# Altium schematic sheet Targets_old1.SchDoc: Shepherd - Target Interface
size A3; Author: Ingmar; CompanyName: NES Lab / TU Dresden
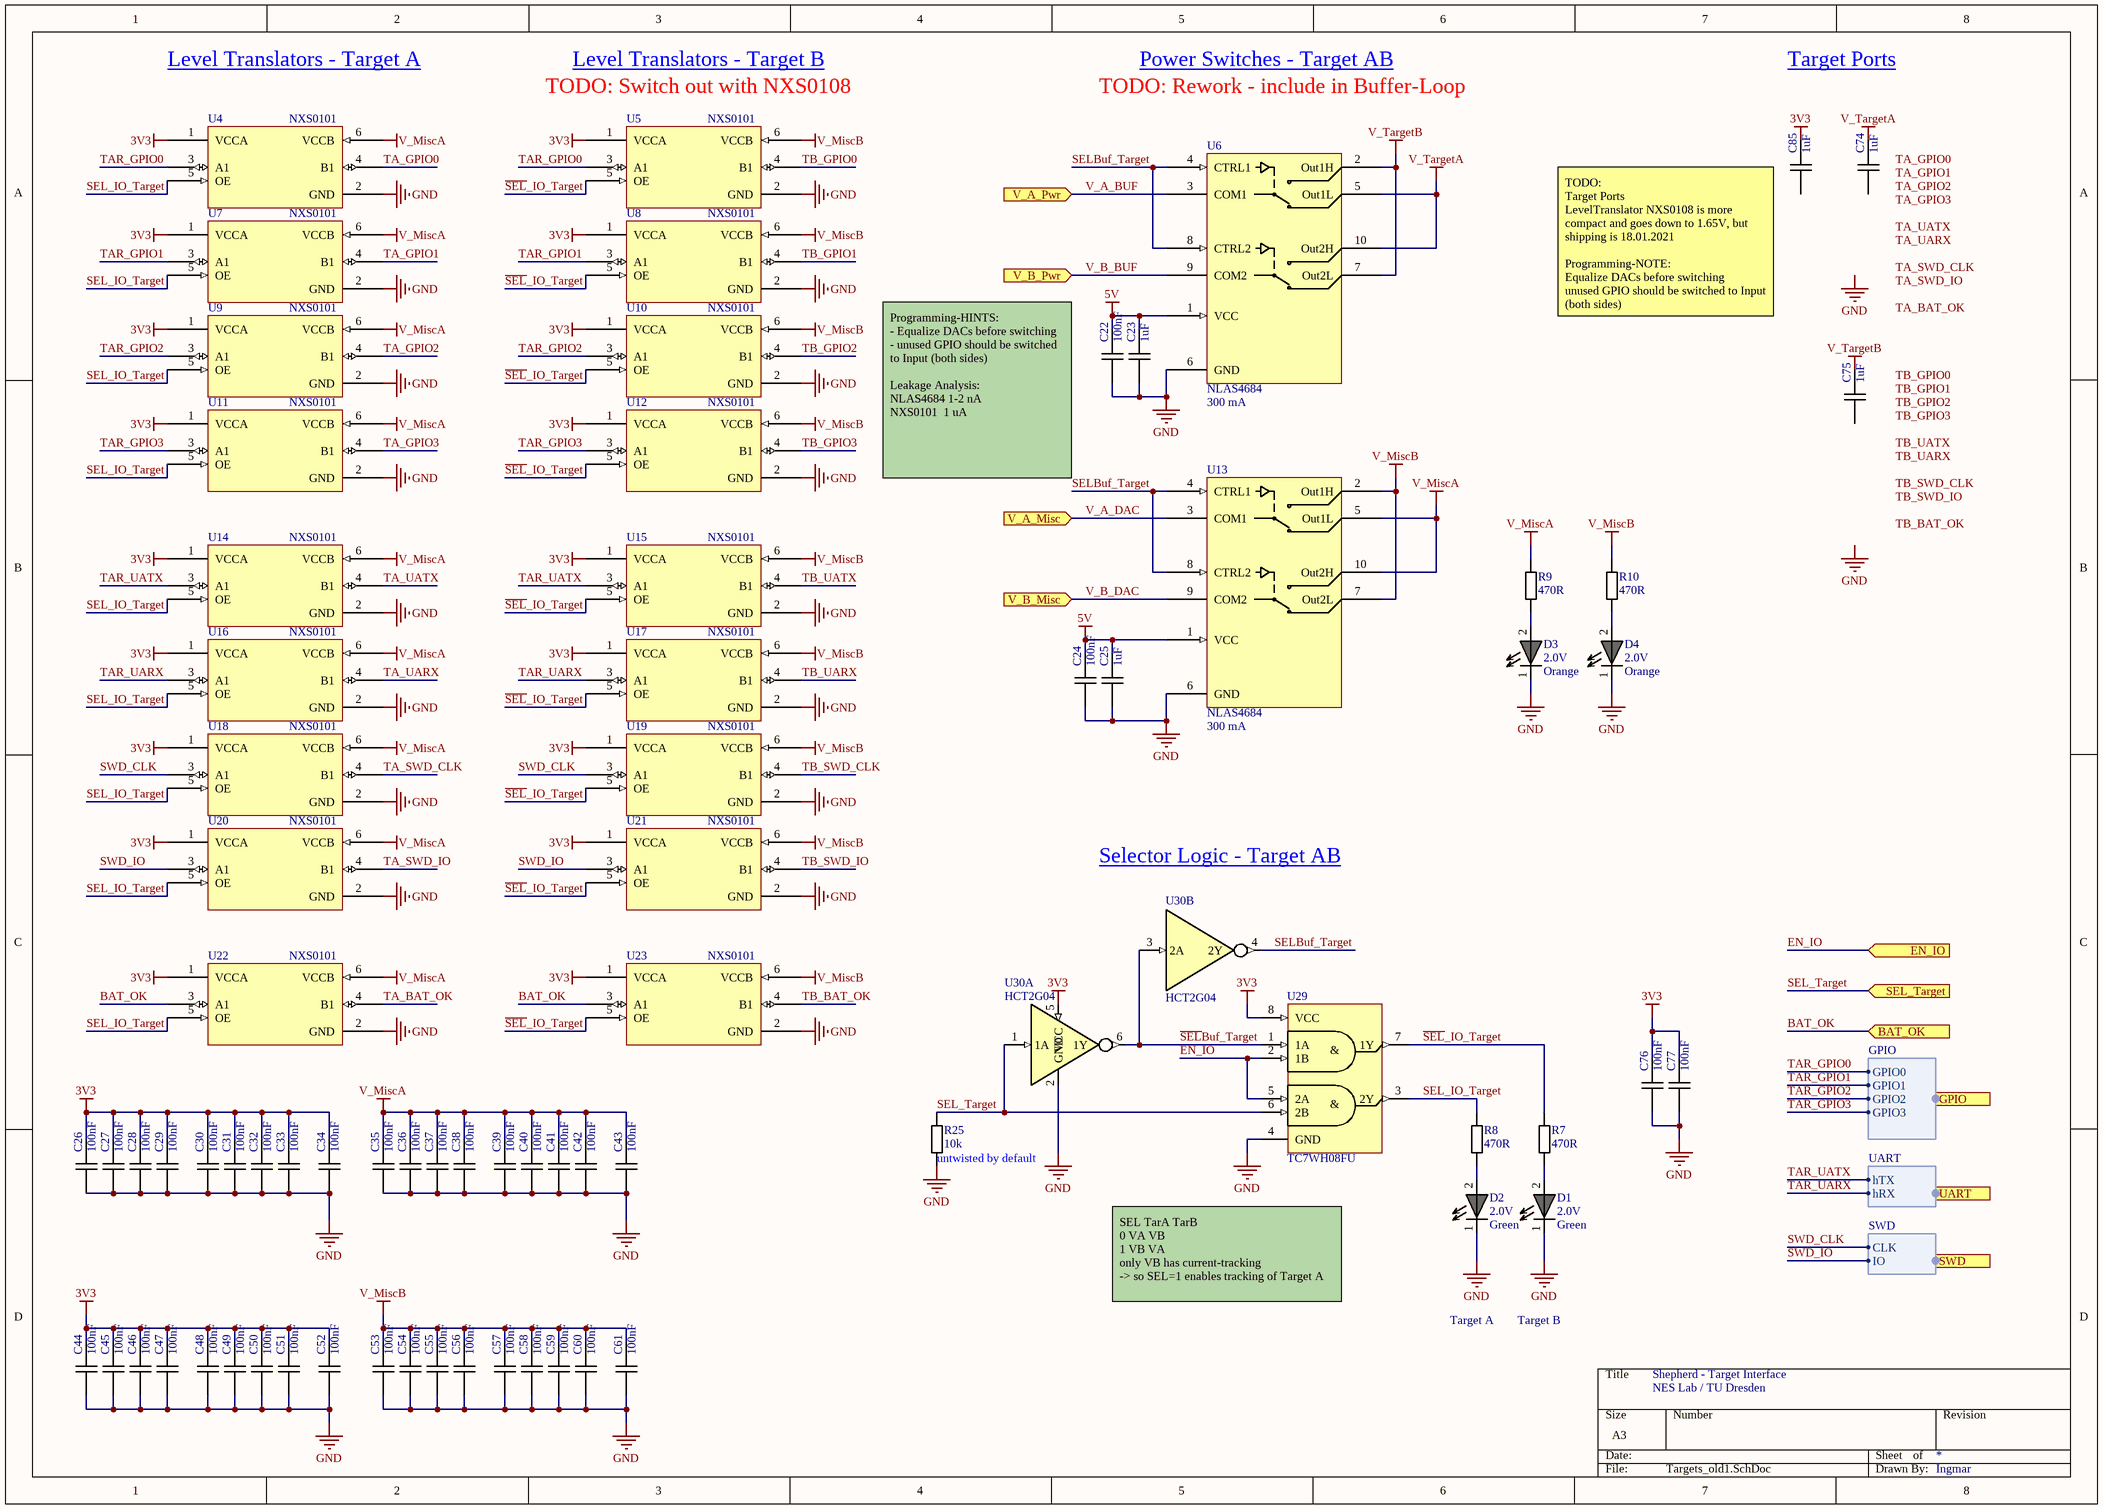
[diagram p0: Targets_old1.SchDoc]

## Parts
C22  value 100nF  [CAPC1005X06]  (hidden comment: .C_0402_100nF_10V)
C23  value 1uF  [CAPC1608X09]  (hidden comment: .C_0603_1uF_10V)
C24  value 100nF  [CAPC1005X06]  (hidden comment: .C_0402_100nF_10V)
C25  value 1uF  [CAPC1608X09]  (hidden comment: .C_0603_1uF_10V)
C26  value 100nF  [CAPC1005X06]  (hidden comment: .C_0402_100nF_10V)
C27  value 100nF  [CAPC1005X06]  (hidden comment: .C_0402_100nF_10V)
C28  value 100nF  [CAPC1005X06]  (hidden comment: .C_0402_100nF_10V)
C29  value 100nF  [CAPC1005X06]  (hidden comment: .C_0402_100nF_10V)
C30  value 100nF  [CAPC1005X06]  (hidden comment: .C_0402_100nF_10V)
C31  value 100nF  [CAPC1005X06]  (hidden comment: .C_0402_100nF_10V)
C32  value 100nF  [CAPC1005X06]  (hidden comment: .C_0402_100nF_10V)
C33  value 100nF  [CAPC1005X06]  (hidden comment: .C_0402_100nF_10V)
C34  value 100nF  [CAPC1005X06]  (hidden comment: .C_0402_100nF_10V)
C35  value 100nF  [CAPC1005X06]  (hidden comment: .C_0402_100nF_10V)
C36  value 100nF  [CAPC1005X06]  (hidden comment: .C_0402_100nF_10V)
C37  value 100nF  [CAPC1005X06]  (hidden comment: .C_0402_100nF_10V)
C38  value 100nF  [CAPC1005X06]  (hidden comment: .C_0402_100nF_10V)
C39  value 100nF  [CAPC1005X06]  (hidden comment: .C_0402_100nF_10V)
C40  value 100nF  [CAPC1005X06]  (hidden comment: .C_0402_100nF_10V)
C41  value 100nF  [CAPC1005X06]  (hidden comment: .C_0402_100nF_10V)
C42  value 100nF  [CAPC1005X06]  (hidden comment: .C_0402_100nF_10V)
C43  value 100nF  [CAPC1005X06]  (hidden comment: .C_0402_100nF_10V)
C44  value 100nF  [CAPC1005X06]  (hidden comment: .C_0402_100nF_10V)
C45  value 100nF  [CAPC1005X06]  (hidden comment: .C_0402_100nF_10V)
C46  value 100nF  [CAPC1005X06]  (hidden comment: .C_0402_100nF_10V)
C47  value 100nF  [CAPC1005X06]  (hidden comment: .C_0402_100nF_10V)
C48  value 100nF  [CAPC1005X06]  (hidden comment: .C_0402_100nF_10V)
C49  value 100nF  [CAPC1005X06]  (hidden comment: .C_0402_100nF_10V)
C50  value 100nF  [CAPC1005X06]  (hidden comment: .C_0402_100nF_10V)
C51  value 100nF  [CAPC1005X06]  (hidden comment: .C_0402_100nF_10V)
C52  value 100nF  [CAPC1005X06]  (hidden comment: .C_0402_100nF_10V)
C53  value 100nF  [CAPC1005X06]  (hidden comment: .C_0402_100nF_10V)
C54  value 100nF  [CAPC1005X06]  (hidden comment: .C_0402_100nF_10V)
C55  value 100nF  [CAPC1005X06]  (hidden comment: .C_0402_100nF_10V)
C56  value 100nF  [CAPC1005X06]  (hidden comment: .C_0402_100nF_10V)
C57  value 100nF  [CAPC1005X06]  (hidden comment: .C_0402_100nF_10V)
C58  value 100nF  [CAPC1005X06]  (hidden comment: .C_0402_100nF_10V)
C59  value 100nF  [CAPC1005X06]  (hidden comment: .C_0402_100nF_10V)
C60  value 100nF  [CAPC1005X06]  (hidden comment: .C_0402_100nF_10V)
C61  value 100nF  [CAPC1005X06]  (hidden comment: .C_0402_100nF_10V)
C74  value 1uF  [CAPC1608X09]  (hidden comment: .C_0603_1uF_10V)
C75  value 1uF  [CAPC1608X09]  (hidden comment: .C_0603_1uF_10V)
C76  value 100nF  [CAPC1005X06]  (hidden comment: .C_0402_100nF_10V)
C77  value 100nF  [CAPC1005X06]  (hidden comment: .C_0402_100nF_10V)
C85  value 1uF  [CAPC1608X09]  (hidden comment: .C_0603_1uF_10V)
D1  value Green  V_max: 2.0V  [DIOM1608X02N Green]  (hidden comment: .D_LED_0603_Green)
D2  value Green  V_max: 2.0V  [DIOM1608X02N Green]  (hidden comment: .D_LED_0603_Green)
D3  value Orange  V_max: 2.0V  [DIOM1608X02N Orange]  (hidden comment: .D_LED_0603_Orange)
D4  value Orange  V_max: 2.0V  [DIOM1608X02N Orange]  (hidden comment: .D_LED_0603_Orange)
R7  value 470R  [RESC1005X04]  (hidden comment: .R_0402_470R)
R8  value 470R  [RESC1005X04]  (hidden comment: .R_0402_470R)
R9  value 470R  [RESC1005X04]  (hidden comment: .R_0402_470R)
R10  value 470R  [RESC1005X04]  (hidden comment: .R_0402_470R)
R25  value 10k  [RESC1005X04]  (hidden comment: .R_0402_10k)
U4  NXS0101  [SON50P100X50-6N SOT886]
U5  NXS0101  [SON50P100X50-6N SOT886]
U6  NLAS4684  I_max: 300 mA  [PSON50P300X100_HS-11N]
U7  NXS0101  [SON50P100X50-6N SOT886]
U8  NXS0101  [SON50P100X50-6N SOT886]
U9  NXS0101  [SON50P100X50-6N SOT886]
U10  NXS0101  [SON50P100X50-6N SOT886]
U11  NXS0101  [SON50P100X50-6N SOT886]
U12  NXS0101  [SON50P100X50-6N SOT886]
U13  NLAS4684  I_max: 300 mA  [PSON50P300X100_HS-11N]
U14  NXS0101  [SON50P100X50-6N SOT886]
U15  NXS0101  [SON50P100X50-6N SOT886]
U16  NXS0101  [SON50P100X50-6N SOT886]
U17  NXS0101  [SON50P100X50-6N SOT886]
U18  NXS0101  [SON50P100X50-6N SOT886]
U19  NXS0101  [SON50P100X50-6N SOT886]
U20  NXS0101  [SON50P100X50-6N SOT886]
U21  NXS0101  [SON50P100X50-6N SOT886]
U22  NXS0101  [SON50P100X50-6N SOT886]
U23  NXS0101  [SON50P100X50-6N SOT886]
U29  TC7WH08FU  [TSOP65P400X120-8N]
U30  HCT2G04  [SOT65P210X110-6N]  (parts A,B of 2)

## Ports
BAT_OK (in), EN_IO (in), GPIO (in, harness GPIO), SEL_Target (in), SWD (in, harness SWD), UART (in, harness UART), V_A_Misc (in), V_A_Pwr (in), V_B_Misc (in), V_B_Pwr (in)

## Harnesses
GPIO: GPIO0, GPIO1, GPIO2, GPIO3
SWD: CLK, IO
UART: hTX, hRX

## Nets
3V3: C26.2 C27.2 C28.2 C29.2 C30.2 C31.2 C32.2 C33.2 C34.2 C44.2 C45.2 C46.2 C47.2 C48.2 C49.2 C50.2 C51.2 C52.2 C76.2 C77.2 C85.2 U4.1(VCCA) U5.1(VCCA) U7.1(VCCA) U8.1(VCCA) U9.1(VCCA) U10.1(VCCA) U11.1(VCCA) U12.1(VCCA) U14.1(VCCA) U15.1(VCCA) U16.1(VCCA) U17.1(VCCA) U18.1(VCCA) U19.1(VCCA) U20.1(VCCA) U21.1(VCCA) U22.1(VCCA) U23.1(VCCA) U29.8(VCC) U30.5(VCC)
5V: C22.2 C23.2 C24.2 C25.2 U6.1(VCC) U13.1(VCC)
GND: C22.1 C23.1 C24.1 C25.1 C26.1 C27.1 C28.1 C29.1 C30.1 C31.1 C32.1 C33.1 C34.1 C35.1 C36.1 C37.1 C38.1 C39.1 C40.1 C41.1 C42.1 C43.1 C44.1 C45.1 C46.1 C47.1 C48.1 C49.1 C50.1 C51.1 C52.1 C53.1 C54.1 C55.1 C56.1 C57.1 C58.1 C59.1 C60.1 C61.1 C76.1 C77.1 D1.1 D2.1 D3.1 D4.1 R25.1 U4.2(GND) U5.2(GND) U6.6(GND) U7.2(GND) U8.2(GND) U9.2(GND) U10.2(GND) U11.2(GND) U12.2(GND) U13.6(GND) U14.2(GND) U15.2(GND) U16.2(GND) U17.2(GND) U18.2(GND) U19.2(GND) U20.2(GND) U21.2(GND) U22.2(GND) U23.2(GND) U29.4(GND) U30.2(GND)
V_MiscA: C35.2 C36.2 C37.2 C38.2 C39.2 C40.2 C41.2 C42.2 C43.2 R9.2 U4.6(VCCB) U7.6(VCCB) U9.6(VCCB) U11.6(VCCB) U13.5(Out1L) U13.10(Out2H) U14.6(VCCB) U16.6(VCCB) U18.6(VCCB) U20.6(VCCB) U22.6(VCCB)
V_MiscB: C53.2 C54.2 C55.2 C56.2 C57.2 C58.2 C59.2 C60.2 C61.2 R10.2 U5.6(VCCB) U8.6(VCCB) U10.6(VCCB) U12.6(VCCB) U13.2(Out1H) U13.7(Out2L) U15.6(VCCB) U17.6(VCCB) U19.6(VCCB) U21.6(VCCB) U23.6(VCCB)
V_TargetA: C74.2 U6.5(Out1L) U6.10(Out2H)
V_TargetB: C75.2 U6.2(Out1H) U6.7(Out2L)
BAT_OK: U22.3(A1) U23.3(A1) ; port BAT_OK
EN_IO: U29.2(1B) U29.5(2A) ; port EN_IO
~{SEL}_IO_Target: R7.2 U5.5(OE) U8.5(OE) U10.5(OE) U12.5(OE) U15.5(OE) U17.5(OE) U19.5(OE) U21.5(OE) U23.5(OE) U29.7(1Y)
~{SEL}Buf_Target: U29.1(1A) U30.3(2A) U30.6(1Y)
SEL_IO_Target: R8.2 U4.5(OE) U7.5(OE) U9.5(OE) U11.5(OE) U14.5(OE) U16.5(OE) U18.5(OE) U20.5(OE) U22.5(OE) U29.3(2Y)
SEL_Target: R25.2 U29.6(2B) U30.1(1A) ; port SEL_Target
SELBuf_Target: U6.4(CTRL1) U6.8(CTRL2) U13.4(CTRL1) U13.8(CTRL2) U30.4(2Y)
SWD_CLK: U18.3(A1) U19.3(A1) ; port SWD.CLK
SWD_IO: U20.3(A1) U21.3(A1) ; port SWD.IO
TA_BAT_OK: U22.4(B1)
TA_GPIO0: U4.4(B1)
TA_GPIO1: U7.4(B1)
TA_GPIO2: U9.4(B1)
TA_GPIO3: U11.4(B1)
TA_SWD_CLK: U18.4(B1)
TA_SWD_IO: U20.4(B1)
TA_UARX: U16.4(B1)
TA_UATX: U14.4(B1)
TAR_GPIO0: U4.3(A1) U5.3(A1) ; port GPIO.GPIO0
TAR_GPIO1: U7.3(A1) U8.3(A1) ; port GPIO.GPIO1
TAR_GPIO2: U9.3(A1) U10.3(A1) ; port GPIO.GPIO2
TAR_GPIO3: U11.3(A1) U12.3(A1) ; port GPIO.GPIO3
TAR_UARX: U16.3(A1) U17.3(A1) ; port UART.hRX
TAR_UATX: U14.3(A1) U15.3(A1) ; port UART.hTX
TB_BAT_OK: U23.4(B1)
TB_GPIO0: U5.4(B1)
TB_GPIO1: U8.4(B1)
TB_GPIO2: U10.4(B1)
TB_GPIO3: U12.4(B1)
TB_SWD_CLK: U19.4(B1)
TB_SWD_IO: U21.4(B1)
TB_UARX: U17.4(B1)
TB_UATX: U15.4(B1)
V_A_BUF: U6.3(COM1) ; port V_A_Pwr
V_A_DAC: U13.3(COM1) ; port V_A_Misc
V_B_BUF: U6.9(COM2) ; port V_B_Pwr
V_B_DAC: U13.9(COM2) ; port V_B_Misc
NetD1_2: D1.2 R7.1
NetD2_2: D2.2 R8.1
NetD3_2: D3.2 R9.1
NetD4_2: D4.2 R10.1

Not connected (* = marked no-connect by the designer): C74 1; C75 1; C85 1

## Notes on the sheet
- Level Translators - Target A
- (near U5) TODO: Switch out with NXS0108
- Level Translators - Target B
- TODO: Rework - include in Buffer-Loop
- Power Switches - Target AB
- Target Ports
- (near C85) TODO:
  Target Ports
  LevelTranslator NXS0108 is more compact and goes down to 1.65V, but shipping is 18.01.2021
  Programming-NOTE:
  Equalize DACs before switching
  unused GPIO should be switched to Input (both sides)
- (near C22) Programming-HINTS:
  - Equalize DACs before switching
  - unused GPIO should be switched to Input (both sides)
  Leakage Analysis:
  NLAS4684	1-2 nA
  NXS0101		1 uA
- Selector Logic - Target AB
- (near R25) untwisted by default
- SEL	TarA	TarB
  0	VA	VB
  1	VB	VA
  only VB has current-tracking
  -> so SEL=1 enables tracking of Target A
- Target A
- Target B
- Labels drawn without touching a wire or pin: GND, TA_BAT_OK, TA_GPIO0, TA_GPIO1, TA_GPIO2, TA_GPIO3, TA_SWD_CLK, TA_SWD_IO, TA_UARX, TA_UATX, TB_BAT_OK, TB_GPIO0, TB_GPIO1, TB_GPIO2, TB_GPIO3, TB_SWD_CLK, TB_SWD_IO, TB_UARX, TB_UATX
- (in symbol TC7WH08FU) &

## Library data of the parts
C22 C24 C26-C61 C76 C77 = .C_0402_100nF_10V: Capacitor; Manufacturer: Murata; Manufacturer PN: GCM155R71A104KA55D; V_max: 10V; Tolerance: 10%; Dielectric: X7R; Distributer: Mouser; Distributer PN: 81-GCM155R71A104K5D; Price n10 [€]: 0.03
C23 C25 C74 C75 C85 = .C_0603_1uF_10V: Capacitor; Manufacturer: KEMET; Manufacturer PN: C0603C105K8RACTU; V_max: 10V; Tolerance: 10%; Dielectric: X7R; Distributer: Mouser; Distributer PN: 80-C0603C105K8R; Price n10 [€]: 0.03
D1 D2 = .D_LED_0603_Green: LED YellowGreen 575nm, 0603, 60mcd 2V@20mA; Manufacturer: Wuerth; Manufacturer PN: 150060VS55040; I_max: 20mA; I_typ: 5mA; V_typ: 1.85V; Distributer: Mouser; Distributer PN: 710-150060VS55040; Price n10 [€]: 0.14
D3 D4 = .D_LED_0603_Orange: LED RedOrange 632nm, 0603, 90 mcd, 2V@20mA; Manufacturer: Wuerth; Manufacturer PN: 150060RS55040; I_max: 20mA; I_typ: 5mA; V_typ: 1.85V; Distributer: Mouser; Distributer PN: 710-150060RS55040; Price n10 [€]: 0.14
R7-R10 = .R_0402_470R: Resistor; Manufacturer: Panasonic; Manufacturer PN: ERJ-2GEJ471X; P_max: 100mW; V_max: 50V; Tolerance: 5%; Distributer: Mouser; Distributer PN: 667-ERJ-2GEJ471X; Price n10 [€]: 0.02
R25 = .R_0402_10k: Resistor; Manufacturer: Panasonic; Manufacturer PN: ERJ-2GEJ103X; P_max: 100mW; V_max: 50V; Tolerance: 5%; Distributer: Mouser; Distributer PN: 667-ERJ-2GEJ103X; Price n10 [€]: 0.02
U4 U5 U7-U12 U14-U23 = NXS0101: Level Translator, auto direction sensing, open drain (with internal 10k PU), VCCA 1.65-3.6V, VCCB 2.3-5.5V, 24 Mbps. 1uA leakage; Manufacturer: Nexperia; Manufacturer PN: NXS0101GMX; V_max: 5.5V; V_min: 1.65V; Distributer: Mouser; Distributer PN: 771-NXS0101GMX; Price n10 [€]: 0.27
U6 U13 = NLAS4684-MN: Analog Switch, Dual SPDT, 500 mOhm Rds, 300 mA continuous, 500 mA peak, <10 nA Leakage; Manufacturer: ON Semi; Manufacturer PN: NLAS4684MNR2G; V_max: 5.5; V_min: 1.8V; Distributer: Mouser; Distributer PN: 863-NLAS4684MNR2G; Price n10 [€]: 0.63
U29 = TC7WH08FU: Logic Gate, 2-Channel 2-Input AND Gate, 25 mA IOut max,; Manufacturer: Toshiba; Manufacturer PN: TC7WH08FK,LJ(CT; I_max: 40uA; V_max: 5.5V; V_min: 2V; Distributer: Mouser; Distributer PN: 757-TC7WH08FKLJCT; Price n10 [€]: 0.24
U30 = HCT2G04: Inverter Dual, Buffered, I_out +- 25mA max,; Manufacturer: Nexperia; Manufacturer PN: 74HC2G04GW,125; V_max: 6.0V; V_min: 2.0V; I_max: 400uA; Distributer: Mouser; Distributer PN: 771-HC2G04GW125; Price n10 [€]: 0.21